# EAGLE schematic common emitter-piccolo segnale (EAGLE 9.6.2)
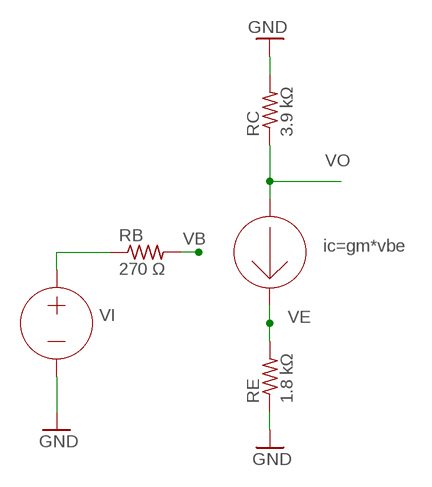
[diagram p0: schematic, sheet 1]

## Parts
1  ic=gm*vbe  CURRENT  (no package)
RB  270 Ω  R-US_0204/5  [0204/5]
RC  3.9 kΩ  R-US_0204/5  [0204/5]
RE  1.8 kΩ  R-US_0204/5  [0204/5]
VI  0V  VOLTAGE  (no package)

## Nets
GND: RC.2 RE.1 VI.-
N$3: RB.1 VI.+
VB: RB.2
VE: 1.- RE.2
VO: 1.+ RC.1

## Library data of the parts
1 = ngspice-simulation:CURRENT: Independent Current Source; VALUE: 0A
RB RC RE = rcl:R-US_: RESISTOR, American symbol; SPICEPREFIX: R
VI = ngspice-simulation:VOLTAGE: Independent Voltage Source, either DC, AC, PULSE, SINE, PWL, EXP, or SFFM